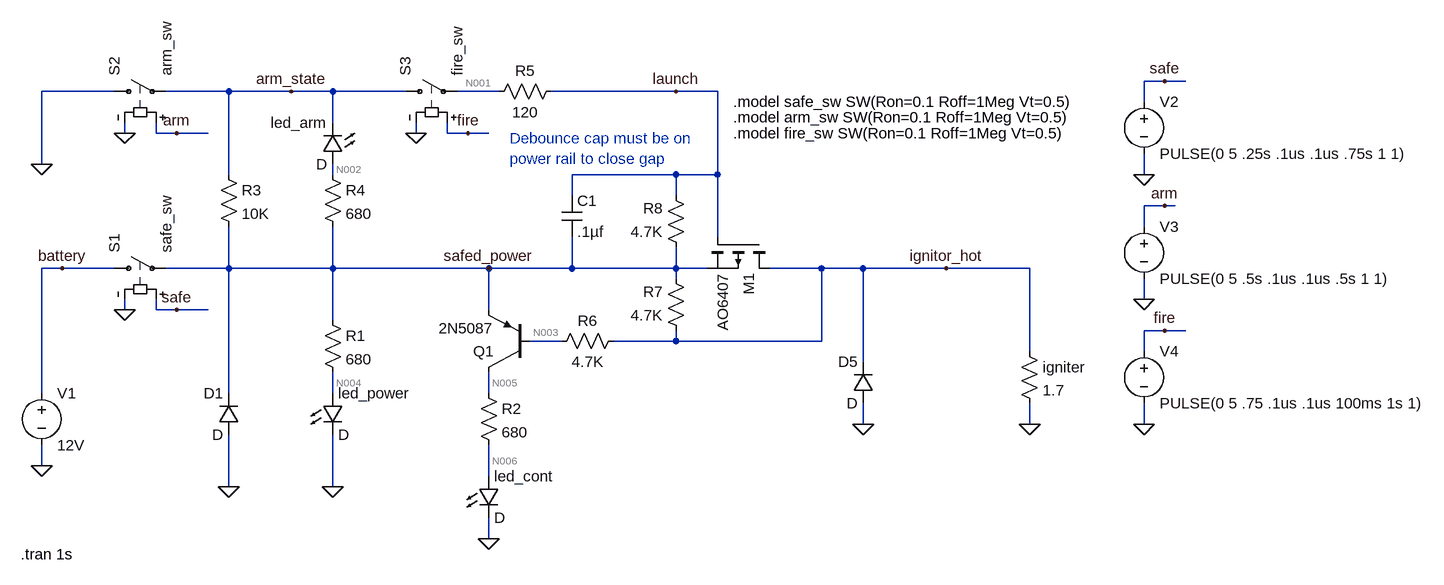
[diagram p0: schematic 2026-08-09_12v-ignition-circuit_r00.asc]
2026-08-09_12v-ignition-circuit_r00.asc, the LTspice schematic file:
Version 4.1
SHEET 1 2148 680
WIRE 1728 -320 1696 -320
WIRE 1760 -320 1728 -320
WIRE 112 -304 0 -304
WIRE 288 -304 192 -304
WIRE 384 -304 288 -304
WIRE 448 -304 384 -304
WIRE 560 -304 448 -304
WIRE 704 -304 640 -304
WIRE 976 -304 784 -304
WIRE 1040 -304 976 -304
WIRE 1696 -288 1696 -320
WIRE 448 -256 448 -304
WIRE 128 -240 128 -256
WIRE 176 -240 176 -256
WIRE 208 -240 176 -240
WIRE 256 -240 208 -240
WIRE 576 -240 576 -256
WIRE 624 -240 624 -256
WIRE 656 -240 624 -240
WIRE 688 -240 656 -240
WIRE 0 -192 0 -304
WIRE 288 -176 288 -304
WIRE 448 -176 448 -192
WIRE 976 -176 816 -176
WIRE 1040 -176 1040 -304
WIRE 1040 -176 976 -176
WIRE 1696 -176 1696 -208
WIRE 816 -144 816 -176
WIRE 976 -144 976 -176
WIRE 1728 -128 1696 -128
WIRE 1744 -128 1728 -128
WIRE 1696 -96 1696 -128
WIRE 1040 -80 1040 -176
WIRE 32 -32 0 -32
WIRE 112 -32 32 -32
WIRE 288 -32 288 -96
WIRE 288 -32 192 -32
WIRE 448 -32 448 -96
WIRE 448 -32 288 -32
WIRE 688 -32 448 -32
WIRE 816 -32 816 -80
WIRE 816 -32 688 -32
WIRE 976 -32 976 -64
WIRE 976 -32 816 -32
WIRE 1024 -32 976 -32
WIRE 1200 -32 1120 -32
WIRE 1264 -32 1200 -32
WIRE 1392 -32 1264 -32
WIRE 1520 -32 1392 -32
WIRE 976 -16 976 -32
WIRE 1696 16 1696 -16
WIRE 128 32 128 16
WIRE 176 32 176 16
WIRE 208 32 176 32
WIRE 256 32 208 32
WIRE 688 32 688 -32
WIRE 448 48 448 -32
WIRE 1728 64 1696 64
WIRE 1760 64 1728 64
WIRE 800 80 752 80
WIRE 976 80 976 64
WIRE 976 80 880 80
WIRE 1200 80 1200 -32
WIRE 1200 80 976 80
WIRE 1520 96 1520 -32
WIRE 1696 96 1696 64
WIRE 1264 112 1264 -32
WIRE 0 160 0 -32
WIRE 288 160 288 -32
WIRE 448 160 448 128
WIRE 688 160 688 128
WIRE 1264 208 1264 176
WIRE 1520 208 1520 176
WIRE 1696 208 1696 176
WIRE 0 272 0 240
WIRE 688 288 688 240
WIRE 288 304 288 224
WIRE 448 304 448 224
WIRE 688 384 688 352
FLAG 0 -192 0
FLAG 288 304 0
FLAG 448 304 0
FLAG 1520 208 0
FLAG 1264 208 0
FLAG 688 384 0
FLAG 0 272 0
FLAG 1696 -176 0
FLAG 1696 16 0
FLAG 1696 208 0
FLAG 1728 -320 safe
FLAG 1728 -128 arm
FLAG 1728 64 fire
FLAG 576 -240 0
FLAG 128 -240 0
FLAG 128 32 0
FLAG 208 32 safe
FLAG 208 -240 arm
FLAG 656 -240 fire
FLAG 688 -32 safed_power
FLAG 1392 -32 ignitor_hot
FLAG 32 -32 battery
FLAG 384 -304 arm_state
FLAG 976 -304 launch
SYMBOL voltage 0 144 R0
WINDOW 123 0 0 Left 0
WINDOW 39 0 0 Left 0
SYMATTR InstName V1
SYMATTR Value 12V
SYMBOL diode 304 224 R180
WINDOW 0 24 64 Left 2
WINDOW 3 24 0 Left 2
SYMATTR InstName D1
SYMBOL res 432 32 R0
SYMATTR InstName R1
SYMATTR Value 680
SYMBOL res 672 144 R0
SYMATTR InstName R2
SYMATTR Value 680
SYMBOL LED 432 160 R0
SYMATTR InstName led_power
SYMBOL LED 672 288 R0
SYMATTR InstName led_cont
SYMBOL res 272 -192 R0
SYMATTR InstName R3
SYMATTR Value 10K
SYMBOL res 432 -192 R0
SYMATTR InstName R4
SYMATTR Value 680
SYMBOL res 800 -320 R90
WINDOW 0 0 56 VBottom 2
WINDOW 3 32 56 VTop 2
SYMATTR InstName R5
SYMATTR Value 120
SYMBOL pnp 752 128 R180
SYMATTR InstName Q1
SYMATTR Value 2N5087
SYMBOL res 896 64 R90
WINDOW 0 0 56 VBottom 2
WINDOW 3 32 56 VTop 2
SYMATTR InstName R6
SYMATTR Value 4.7K
SYMBOL res 992 80 R180
WINDOW 0 36 76 Left 2
WINDOW 3 36 40 Left 2
SYMATTR InstName R7
SYMATTR Value 4.7K
SYMBOL LED 464 -192 R180
WINDOW 0 24 64 Left 2
WINDOW 3 24 0 Left 2
SYMATTR InstName led_arm
SYMBOL pmos 1120 -80 R90
SYMATTR InstName M1
SYMATTR Value AO6407
SYMBOL res 1504 80 R0
SYMATTR InstName igniter
SYMATTR Value 1.7
SYMBOL diode 1280 176 R180
WINDOW 0 24 64 Left 2
WINDOW 3 24 0 Left 2
SYMATTR InstName D5
SYMBOL cap 800 -144 R0
SYMATTR InstName C1
SYMATTR Value .1µf
SYMBOL res 992 -48 R180
WINDOW 0 36 76 Left 2
WINDOW 3 36 40 Left 2
SYMATTR InstName R8
SYMATTR Value 4.7K
SYMBOL voltage 1696 -304 R0
WINDOW 123 0 0 Left 0
WINDOW 39 0 0 Left 0
SYMATTR InstName V2
SYMATTR Value PULSE(0 5 .25s .1us .1us .75s 1 1)
SYMBOL voltage 1696 -112 R0
WINDOW 123 0 0 Left 0
WINDOW 39 0 0 Left 0
SYMATTR InstName V3
SYMATTR Value PULSE(0 5 .5s .1us .1us .5s 1 1)
SYMBOL voltage 1696 80 R0
WINDOW 123 0 0 Left 0
WINDOW 39 0 0 Left 0
SYMATTR InstName V4
SYMATTR Value PULSE(0 5 .75 .1us .1us 100ms 1s 1)
SYMBOL sw 96 -32 R270
SYMATTR InstName S1
SYMATTR Value safe_sw
SYMBOL sw 96 -304 R270
SYMATTR InstName S2
SYMATTR Value arm_sw
SYMBOL sw 544 -304 R270
SYMATTR InstName S3
SYMATTR Value fire_sw
TEXT -32 408 Left 2 !.tran 1s
TEXT 1064 -288 Left 2 !.model safe_sw SW(Ron=0.1 Roff=1Meg Vt=0.5)
TEXT 1064 -264 Left 2 !.model arm_sw SW(Ron=0.1 Roff=1Meg Vt=0.5)
TEXT 1064 -240 Left 2 !.model fire_sw SW(Ron=0.1 Roff=1Meg Vt=0.5)
TEXT 720 -232 Left 2 ;Debounce cap must be on \npower rail to close gap

The netlist it stands for:
* 2026-08-09_12v-ignition-circuit_r00.asc
V1 battery 0 12V
D1 0 safed_power D
R1 safed_power N004 680
R2 N005 N006 680
D§led_power N004 0 D
D§led_cont N006 0 D
R3 arm_state safed_power 10K
R4 N002 safed_power 680
R5 launch N001 120
Q1 N005 N003 safed_power 0 2N5087
R6 ignitor_hot N003 4.7K
R7 ignitor_hot safed_power 4.7K
D§led_arm N002 arm_state D
M1 ignitor_hot launch safed_power safed_power AO6407
R§igniter ignitor_hot 0 1.7
D5 0 ignitor_hot D
C1 launch safed_power .1µf
R8 safed_power launch 4.7K
V2 safe 0 PULSE(0 5 .25s .1us .1us .75s 1 1)
V3 arm 0 PULSE(0 5 .5s .1us .1us .5s 1 1)
V4 fire 0 PULSE(0 5 .75 .1us .1us 100ms 1s 1)
S1 battery safed_power safe 0 safe_sw
S2 0 arm_state arm 0 arm_sw
S3 arm_state N001 fire 0 fire_sw
.model D D
.lib standard.dio
.model NPN NPN
.model PNP PNP
.lib standard.bjt
.model NMOS NMOS
.model PMOS PMOS
.lib standard.mos
.tran 1s
.model safe_sw SW(Ron=0.1 Roff=1Meg Vt=0.5)
.model arm_sw SW(Ron=0.1 Roff=1Meg Vt=0.5)
.model fire_sw SW(Ron=0.1 Roff=1Meg Vt=0.5)
* Debounce cap must be on
* power rail to close gap
.backanno
.end

* Results of the author's LTspice run, read from the files saved beside the schematic
* Operating Point, zero values left out:
*   V(arm_state) = 55.27 mV
*   V(battery) = 12 V
*   V(ignitor_hot) = 20.21 µV
*   V(launch) = 55.81 mV
*   V(n001) = 55.81 mV
*   V(n002) = 55.81 mV
*   V(n003) = 20.21 µV
*   V(n004) = 55.81 mV
*   V(n005) = 16.89 mV
*   V(n006) = 16.89 mV
*   V(safed_power) = 55.81 mV
*   I(R3) = -54.72 nA
*   I(R5) = 544.6 pA
*   I(R7) = -11.87 µA
*   I(R8) = 544.6 pA
*   I(S1) = -11.94 µA
*   I(S2) = 55.27 nA
*   I(S3) = 544.6 pA
*   I(V1) = -11.94 µA
*   I(igniter) = 11.89 µA
*   Id(M1) = -18.02 nA
*   Is(M1) = 18.02 nA
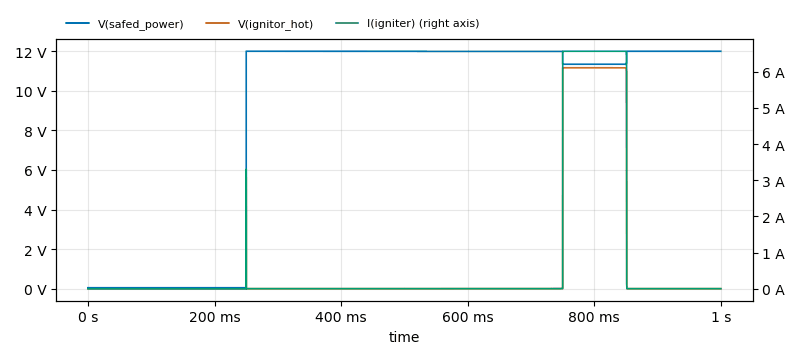
[diagram p1: Transient Analysis of 2026-08-09_12v-ignition-circuit_r00.asc, plotted from the saved traces]
* Transient Analysis, 1 run:
*   V(safed_power): min 55.81 mV, max 12 V, average 8.944 V, rms 10.31 V, last 11.99 V
*   V(ignitor_hot): min 20.21 µV, max 11.16 V, average 1.133 V, rms 3.547 V, last 8.393 mV
*   I(igniter): min 11.89 µA, max 6.566 A, average 666.7 mA, rms 2.087 A, last 4.937 mA